# EAGLE design necklace1206ledfinal1 (EAGLE 7.6.0)
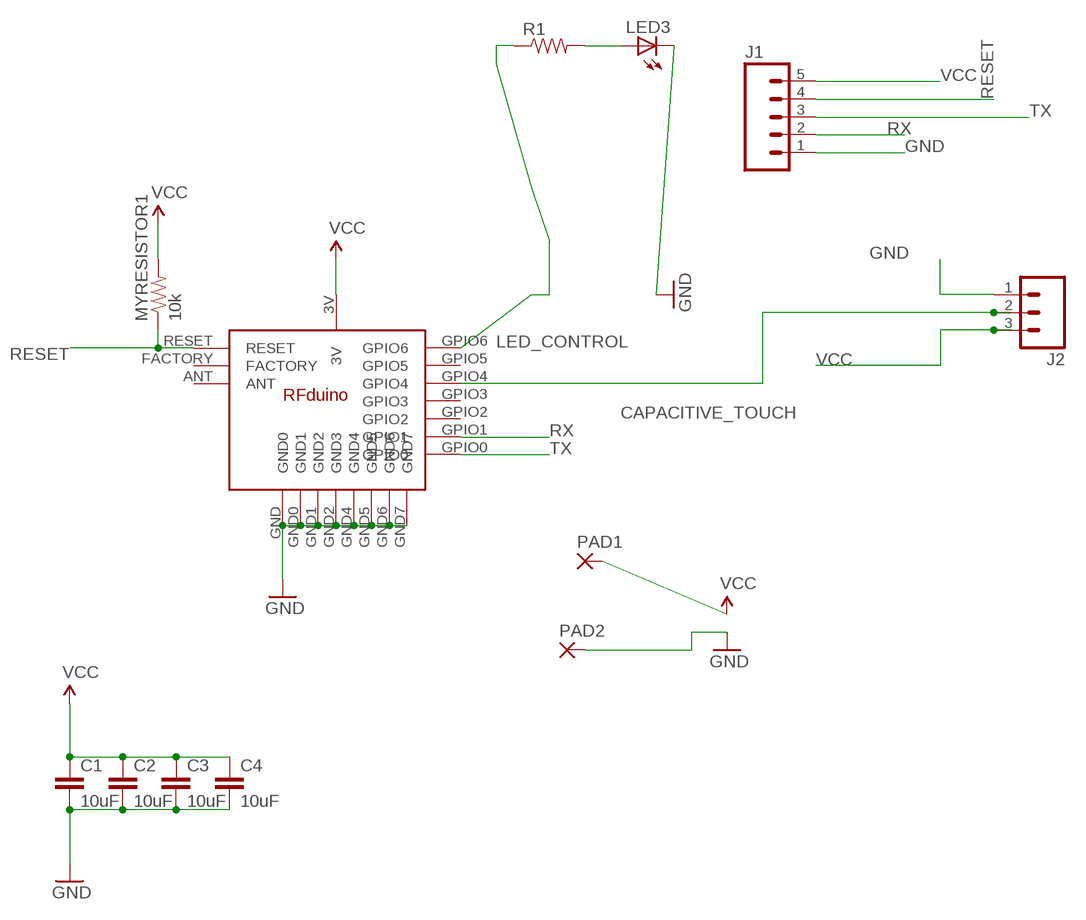
[diagram p0: schematic, sheet 1]

## Parts
C1  10uF  CAP0603-CAP  [0603-CAP]
C2  10uF  CAP0603-CAP  [0603-CAP]
C3  10uF  CAP0603-CAP  [0603-CAP]
C4  10uF  CAP0603-CAP  [0603-CAP]
J1  M05PTH_LONGPADS  [1X05_LONGPADS]
J2  M03LOCK_LONGPADS  [1X03_LOCK_LONGPADS]
LED3  LEDSMT1206  [1206]
MYRESISTOR1  10k  RESISTOR0603-RES  [0603-RES]
PAD1  3,81/1,4  [3,81/1,4]
PAD2  3,81/1,4  [3,81/1,4]
R1  RESISTOR0603  [0603-RES]
U$2  RFDUINO  [RFDUINO]

## Nets
CAPACITIVE_TOUCH: J2.2 U$2.GPIO4
GND: C1.2 C2.2 C3.2 C4.2 J1.1 J2.1 LED3.C PAD2.1(P) U$2.GND0(GND1) U$2.GND1(GND2) U$2.GND2(GND3) U$2.GND4 U$2.GND5 U$2.GND6 U$2.GND7 U$2.GND(GND0)
LED_CONTROL: R1.1 U$2.GPIO6
N$4: LED3.A R1.2
RESET: J1.4 MYRESISTOR1.1 U$2.RESET
RX: J1.2 U$2.GPIO1
TX: J1.3 U$2.GPIO0
VCC: C1.1 C2.1 C3.1 C4.1 J1.5 J2.3 MYRESISTOR1.2 PAD1.1(P) U$2.3V
Unconnected: U$2.ANT U$2.FACTORY U$2.GPIO2 U$2.GPIO3 U$2.GPIO5

## Library data of the parts
C1-C4 = SparkFun:CAP: Capacitor Standard 0603 ceramic capacitor, and 0.1" leaded capacitor.
J1 = SparkFun-Connectors:M05: Header 5 Standard 5-pin 0.1" header. Use with straight break away headers (SKU : PRT-00116), right angle break away headers (PRT-00553), swiss pins (PRT-00743), machine pins (PRT-00117), and female headers (PRT-00115). Molex polarized connector foot print use with SKU : PRT-08230 with associated crimp pins and housings.
J2 = SparkFun-Connectors:M03: Header 3 Standard 3-pin 0.1" header. Use with straight break away headers (SKU : PRT-00116), right angle break away headers (PRT-00553), swiss pins (PRT-00743), machine pins (PRT-00117), and female headers (PRT-00115). Molex polarized connector foot print use with SKU : PRT-08232 with associated crimp pins and housings.
LED3 = adafruit:LED: LED OSRAM: - CHIPLED LG R971, LG N971, LY N971, LG Q971, LY Q971, LO R971, LY R971 LH N974, LH R974 LS Q976, LO Q976, LY Q976 LO Q996 - Hyper CHIPLED LW Q18S LB Q993, LB Q99A, LB R99A - SideLED LS A670, LO A670, LY A670, LG A670, LP A670 LB A673, LV A673, LT A673, LW A673 LH A674 LY A675 LS A676, LA A676, LO A676, LY A676, LW A676 LS A679, LY A679, LG A679 - Hyper Micro SIDELED® LS Y876, LA Y876, LO Y876, LY Y876 LT Y87S - SmartLED LW L88C, LW L88S LB L89C, LB L89S, LG L890 LS L89K, LO L89K, LY L89K LS L896, LA L896, LO L896, LY L896 - TOPLED LS T670, LO T670, LY T670, LG T670, LP T670 LSG T670, LSP T670, LSY T670, LOP T670, LYG T670 LG T671, LOG T671, LSG T671 LB T673, LV T673, LT T673, LW T673 LH T674 LS T676, LA T676, LO T676, LY T676, LB T676, LH T676, LSB T676, LW T676 LB T67C, LV T67C, LT T67C, LS T67K, LO T67K, LY T67K, LW E67C LS E67B, LA E67B, LO E67B, LY E67B, LB E67C, LV E67C, LT E67C LW T67C LS T679, LY T679, LG T679 LS T770, LO T770, LY T770, LG T770, LP T770 LB T773, LV T773, LT T773, LW T773 LH T774 LS E675, LA E675, LY E675, LS T675 LS T776, LA T776, LO T776, LY T776, LB T776 LHGB T686 LT T68C, LB T68C - Hyper Mini TOPLED® LB M676 - Mini TOPLED Santana® LG M470 LS M47K, LO M47K, LY M47K Source: http://www.osram.convergy.de/
MYRESISTOR1 = SparkFun:RESISTOR: Resistor
PAD1 PAD2 = wirepad:3,81/1,4: THROUGH-HOLE PAD
R1 = SparkFun-Resistors:RESISTOR: Resistor
U$2 = myLibrary_yay:RFDUINO

## Net classes
0 default: clearance 0.205 mm

## Board
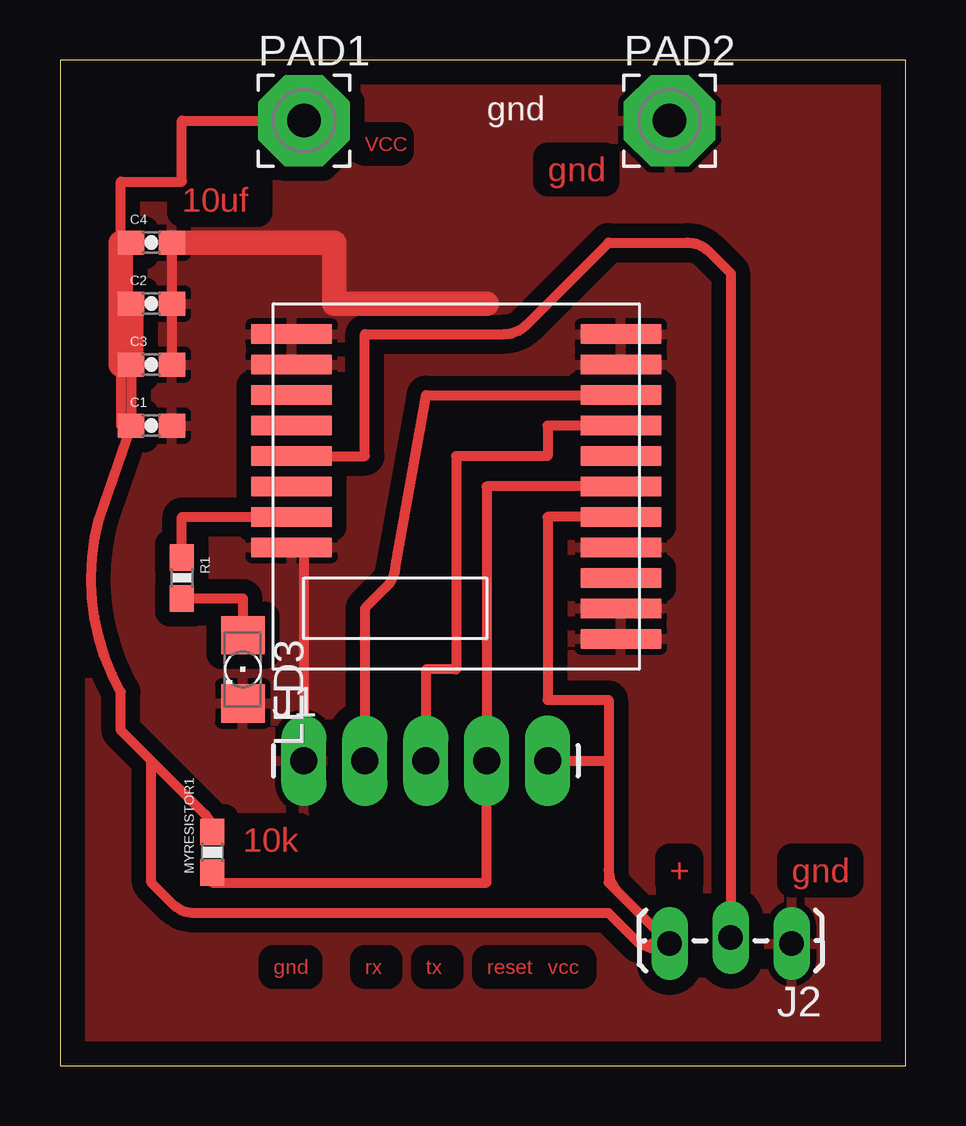
[diagram p1: board, top side]

Size 35.23 x 41.9 mm. Coordinates in mm from the lower left corner, seen from the top.
Outline: 0,0 35.23,0 35.23,41.9 0,41.9 0,0
Copper layers (1*16): Top 0.035mm / dielectric 1.5mm / Bottom 0.035mm
Design rules "default *": minimum track width 4mil, minimum drill 24mil, track to track 8mil, track to pad 8mil, pad to pad 8mil, via to via 8mil, smd to smd 8mil, copper to edge 40mil, drill to drill 8mil, minimum pad ring 10mil, minimum via ring 8mil, stop-mask expansion 4mil, vias tented up to drill 0mil, thermal gap 10mil

### Footprints (pad centres in the part's own frame; a part is rotated, then mirrored left to right if it is on the bottom)
0603-CAP = smd 1.1 x 1: 1 -0.85,0; 2 0.85,0
1X05_LONGPADS = drill 1.118 pad 1.88 long: 1 0,0; 2 2.54,0; 3 5.08,0; 4 7.62,0; 5 10.16,0
1X03_LOCK_LONGPADS = drill 1.016 long: 1 0,0; 2 2.54,-0.254; 3 5.08,0
1206 = smd 1.6 x 1.803: A -1.422,0; C 1.422,0
0603-RES = smd 1.1 x 1: 1 -0.85,0; 2 0.85,0
3,81/1,4 = drill 1.397 pad 3.81 octagon: 1 0,0
RFDUINO = smd 3.353 x 0.813: 3V 6.858,-1.27; ANT 6.858,-3.81; FACTORY 6.858,1.27; GND 6.858,5.08; GND0 6.858,-6.35; GND1 6.858,-5.08; GND2 6.858,-2.54; GND4 6.858,6.35; GND5 -6.858,-2.54; GND6 -6.858,5.08; GND7 -6.858,6.35; GPIO0 6.858,2.54; GPIO1 6.858,3.81; GPIO2 -6.858,3.81; GPIO3 -6.858,2.54; GPIO4 -6.858,1.27; GPIO5 -6.858,0; GPIO6 -6.858,-1.27; RESET 6.858,0

### Placement (x,y rotation side)
C1  3.81,26.67 0 top
C2  3.81,31.75 0 top
C3  3.81,29.21 0 top
C4  3.81,34.29 0 top
J1  10.16,12.7 0 top
J2  30.48,5.08 180 top
LED3  7.62,16.51 270 top
MYRESISTOR1  6.35,8.89 90 top
PAD1  10.16,39.37 0 top
PAD2  25.4,39.37 0 top
R1  5.08,20.32 270 top
U$2  16.51,24.13 0 top

### Tracks (layer width: path | path; a pad name or v marks a point on that pad's centre or on a via)
CAPACITIVE_TOUCH
  Top 0.406: U$2.GPIO4 12.7,25.4 12.7,30.48 18.52,30.48 arc45 19.42,30.85 22.86,34.29 26.14,34.29 arc-45 27.04,33.92 27.94,33.02 J2.2
GND
  Top 0.406: U$2.GND5 10.16,21.59 J1.1 | C3.2 C2.2 C4.2
  Top 1.016: 17.78,31.75 11.43,31.75 11.43,34.29 C4.2
  pour Top (isolate 0.61): 0,0 0,41.91 35.56,41.91 35.56,0
LED_CONTROL
  Top 0.406: R1.1 5.08,22.86 U$2.GPIO6
N$4
  Top 0.406: R1.2 7.62,19.47 LED3.A
RESET
  Top 0.406: MYRESISTOR1.1 6.35,7.62 17.78,7.62 J1.4 17.78,24.13 U$2.RESET
RX
  Top 0.406: J1.2 12.7,19.05 13.6,19.95 arc45 13.97,20.85 15.24,27.94 U$2.GPIO1 24.13,27.94
TX
  Top 0.406: U$2.GPIO0 20.32,26.67 20.32,25.4 16.51,25.4 16.51,16.51 15.24,16.51 J1.3
VCC
  Top 0.406: U$2.3V 20.32,22.86 20.32,15.24 22.86,15.24 22.86,12.7 | 22.86,8.15 arc45 23.23,7.25 J2.3 | MYRESISTOR1.2 arc45 6.05,10.46 3.81,12.7 | 3.81,12.7 2.54,13.97 2.54,15.56 arc-45 1.64,22.81 C1.1 2.96,28.79 arc90 2.54,29.21 | 22.86,8.15 22.86,7.62 J2.3 | J1.5 22.86,12.7 | 22.86,12.7 22.86,8.15 | J2.3 24.66,5.08 arc45 25.03,4.71 24.13,5.08 22.86,6.35 5.61,6.35 arc-45 4.71,6.72 3.81,7.62 3.81,12.7 | C3.1 2.54,29.21 | 2.54,29.21 2.54,26.67 | C4.1 arc-90 2.54,34.71 2.54,36.83 5.08,36.83 5.08,39.37 PAD1.1
  Top 1.016: C4.1 2.54,34.29 2.54,29.21 | C2.1 C3.1

### Text on the board
Top: VCC | gnd | 10uf | 10k | + | gnd | gnd | rx | tx | reset | vcc
tNames: gnd